# EAGLE design PowerMeter (EAGLE 6.5.0)
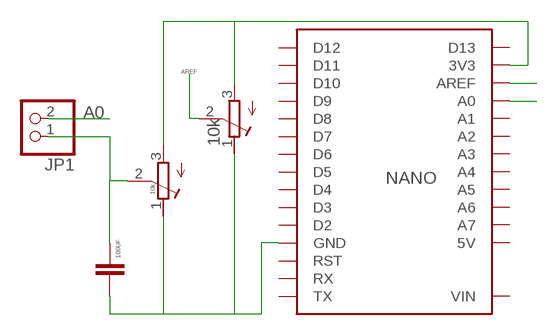
[diagram p0: schematic, sheet 1]

## Parts
100UF  CAPEZ  [CAP-PTH-SMALLEZ]
JP1  PINHD-1X2/90  [1X02/90]
NANO  NANOV3-NO-ICSP  [NANOV3-NO-ICSP]
R1  10k  R-TRIMMT93YA  [RTRIMT93YA]
R3  10k  R-TRIMMT93YA  [RTRIMT93YA]

## Nets
3V3: NANO.3V3 R1.3(E) R3.3(E)
A0: JP1.2 NANO.A0
AREF: NANO.AREF R1.2(S)
GND: 100UF.2 NANO.GND@1(GND) NANO.GND@2(GND) R1.1(A) R3.1(A)
N$1: 100UF.1 JP1.1 R3.2(S)
Unconnected: NANO.5V NANO.A1 NANO.A2 NANO.A3 NANO.A4 NANO.A5 NANO.A6 NANO.A7 NANO.D2 NANO.D3 NANO.D4 NANO.D5 NANO.D6 NANO.D7 NANO.D8 NANO.D9 NANO.D10 NANO.D11 NANO.D12 NANO.D13 NANO.RST1(RST) NANO.RST2(RST) NANO.RX NANO.TX

## Notes on the sheet
- 3V3

## Power pins joined to a net without a drawn wire
VIN: NANO.VIN

## Library data of the parts
100UF = SparkFun-Passives:CAP: Capacitor Standard 0603 ceramic capacitor, and 0.1" leaded capacitor.
JP1 = pinhead:PINHD-1X2: PIN HEADER
NANO = Franc:NANOV3-NO-ICSP: Nano V3 without the ICSP header
R1 R3 = resistor:R-TRIMM: Trimm resistor

## Board
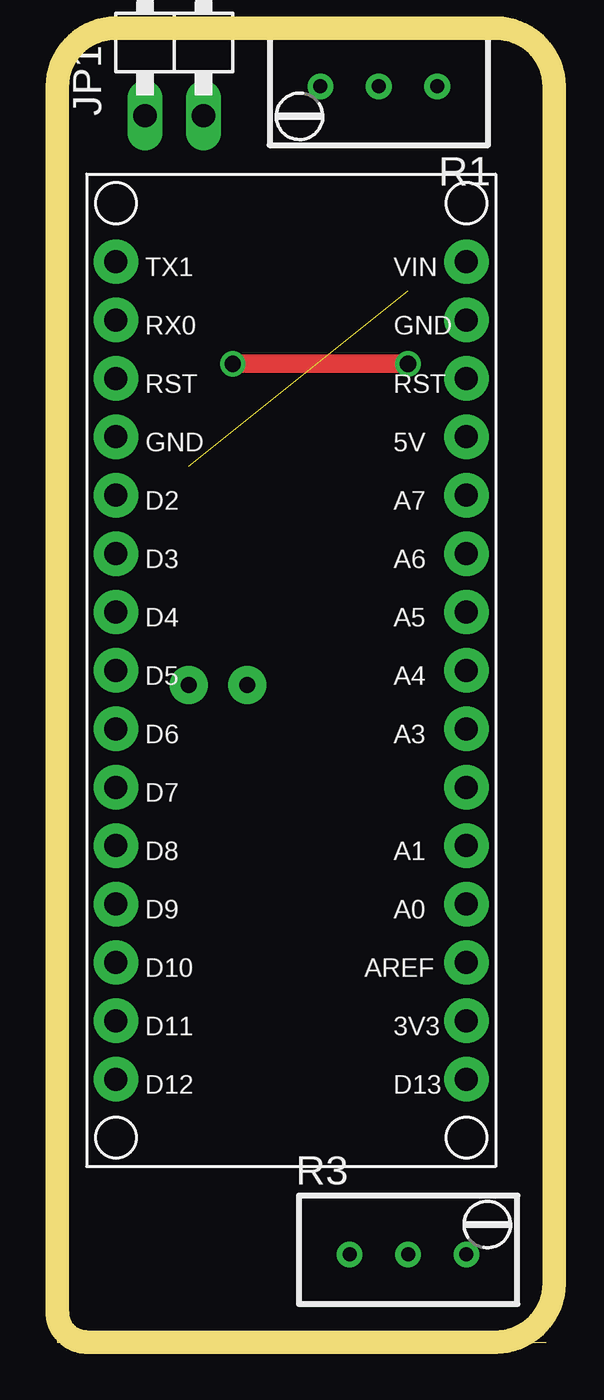
[diagram p1: board, top side]
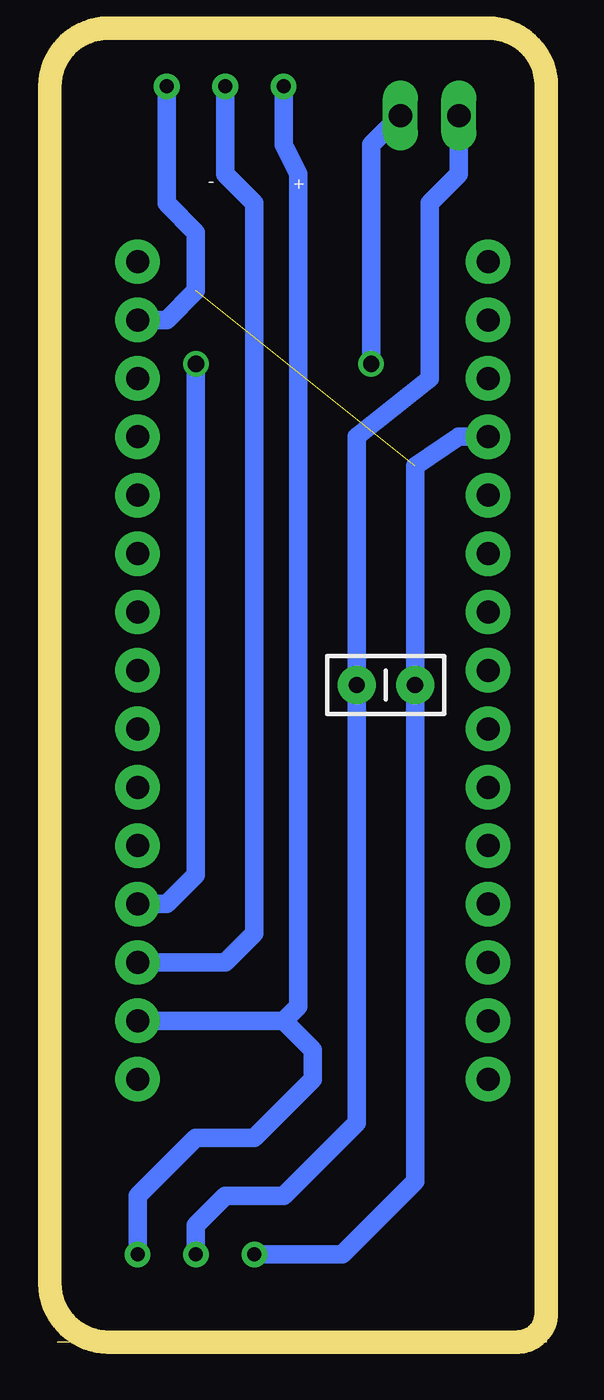
[diagram p2: board, bottom side, seen from below]

Size 21.26 x 55.87 mm. Coordinates in mm from the lower left corner, seen from the top.
Outline: 21.26,0 0,0 0,55.87
Copper layers (1*16): Top 0.035mm / dielectric 1.5mm / Bottom 0.035mm
Design rules "default": minimum track width 10mil, minimum drill 24mil, track to track 8mil, track to pad 8mil, pad to pad 8mil, via to via 8mil, smd to smd 8mil, copper to edge 40mil, drill to drill 8mil, minimum pad ring 10mil, minimum via ring 8mil, stop-mask expansion 4mil, vias tented up to drill 0mil, thermal gap 10mil
Milling: 8 lines

### Footprints (pad centres in the part's own frame; a part is rotated, then mirrored left to right if it is on the bottom)
CAP-PTH-SMALLEZ = drill 0.7 pad 1.651: 1 0,0; 2 2.54,0
1X02/90 = drill 1.016 long: 1 -1.27,-3.81; 2 1.27,-3.81
NANOV3-NO-ICSP = drill 1 pad 1.93: 3V3 3.81,-13.97; 5V 3.81,11.43; A0 3.81,-8.89; A1 3.81,-6.35; A2 3.81,-3.81; A3 3.81,-1.27; A4 3.81,1.27; A5 3.81,3.81; A6 3.81,6.35; A7 3.81,8.89; AREF 3.81,-11.43; D2 -11.43,8.89; D3 -11.43,6.35; D4 -11.43,3.81; D5 -11.43,1.27; D6 -11.43,-1.27; D7 -11.43,-3.81; D8 -11.43,-6.35; D9 -11.43,-8.89; D10 -11.43,-11.43; D11 -11.43,-13.97; D12 -11.43,-16.51; D13 3.81,-16.51; GND@1 -11.43,11.43; GND@2 3.81,16.51; RST1 -11.43,13.97; RST2 3.81,13.97; RX -11.43,16.51; TX -11.43,19.05; VIN 3.81,19.05
RTRIMT93YA = drill 0.61: 1 0,-2.54; 2 0,0; 3 0,2.54

### Placement (x,y rotation side)
100UF  8.26,28.57 0 bottom
JP1  5.08,57.15 0 top
NANO  13.97,27.94 0 top
R1  13.97,54.61 90 top
R3  15.24,3.81 270 top

### Tracks (layer width: path | path; a pad name or v marks a point on that pad's centre or on a via)
3V3
  Bottom 0.813: R1.3 11.43,52.07 10.79,50.8 10.79,14.61 11.43,13.97 | R3.3 17.78,6.35 15.24,8.89 12.7,8.89 10.16,11.43 10.16,12.7 11.43,13.97 | NANO.3V3 11.43,13.97
A0  (via drill 0.7)
  Top 0.813: v7.62,42.55 v15.24,42.55
  Bottom 0.813: v15.24,42.55 15.24,20.32 16.51,19.05 NANO.A0 | JP1.2 7.62,52.07 v7.62,42.55
AREF
  Bottom 0.813: R1.2 13.97,50.8 12.7,49.53 12.7,17.78 13.97,16.51 NANO.AREF
GND  (1 unrouted)
  Bottom 0.813: NANO.GND@1 3.81,39.37 5.71,38.1 100UF.2 5.71,6.99 8.89,3.81 R3.1 | R1.1 16.51,49.53 15.24,48.26 15.24,45.72 16.51,44.45 NANO.GND@2
N$1
  Bottom 0.813: JP1.1 3.81,50.8 5.08,49.53 5.08,41.91 8.26,39.37 100UF.1 8.26,9.53 11.43,6.35 13.97,6.35 15.24,5.08 R3.2

### Text on the board
bNames: + | -